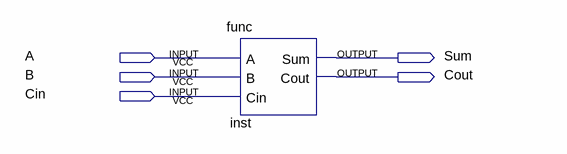
[diagram p0: schematic sheet]
// Quartus schematic bttl.bdf as structural Verilog: 1 symbols, 5 pins
module bttl (
  input  A,
  input  B,
  input  Cin,
  output Sum,
  output Cout
);

  func inst (.A(A), .B(B), .Cin(Cin), .Sum(Sum), .Cout(Cout));
endmodule
